# Altium project SISPS-PV.PrjPcb (part 3 of 4)

## Sheet Bias Regulators 1.SchDoc: System Bias Regulators
size A4; ApprovedBy: LD Stanton; CheckedBy: None; Author: LD Stanton; CompanyName: University of Cape Town; DrawnBy: Lawrence Stanton; Engineer: Lawrence Stanton; Organization: University of Cape Town; Address1: Department of Electrical Engineering; Address2: Rondebosch; Address3: Cape Town; Address4: South Africa 7701; DocumentNumber: 9; SheetNumber: 9; SheetTotal: 20; Approv_Date_Eng: --/--/----; Approv_Date_Chk: --/--/----; PCB_Doc: TBD; ASM_Doc: TBD; FAB_Doc: TBD; CML_Doc: TBD; BOM_Doc: TBD
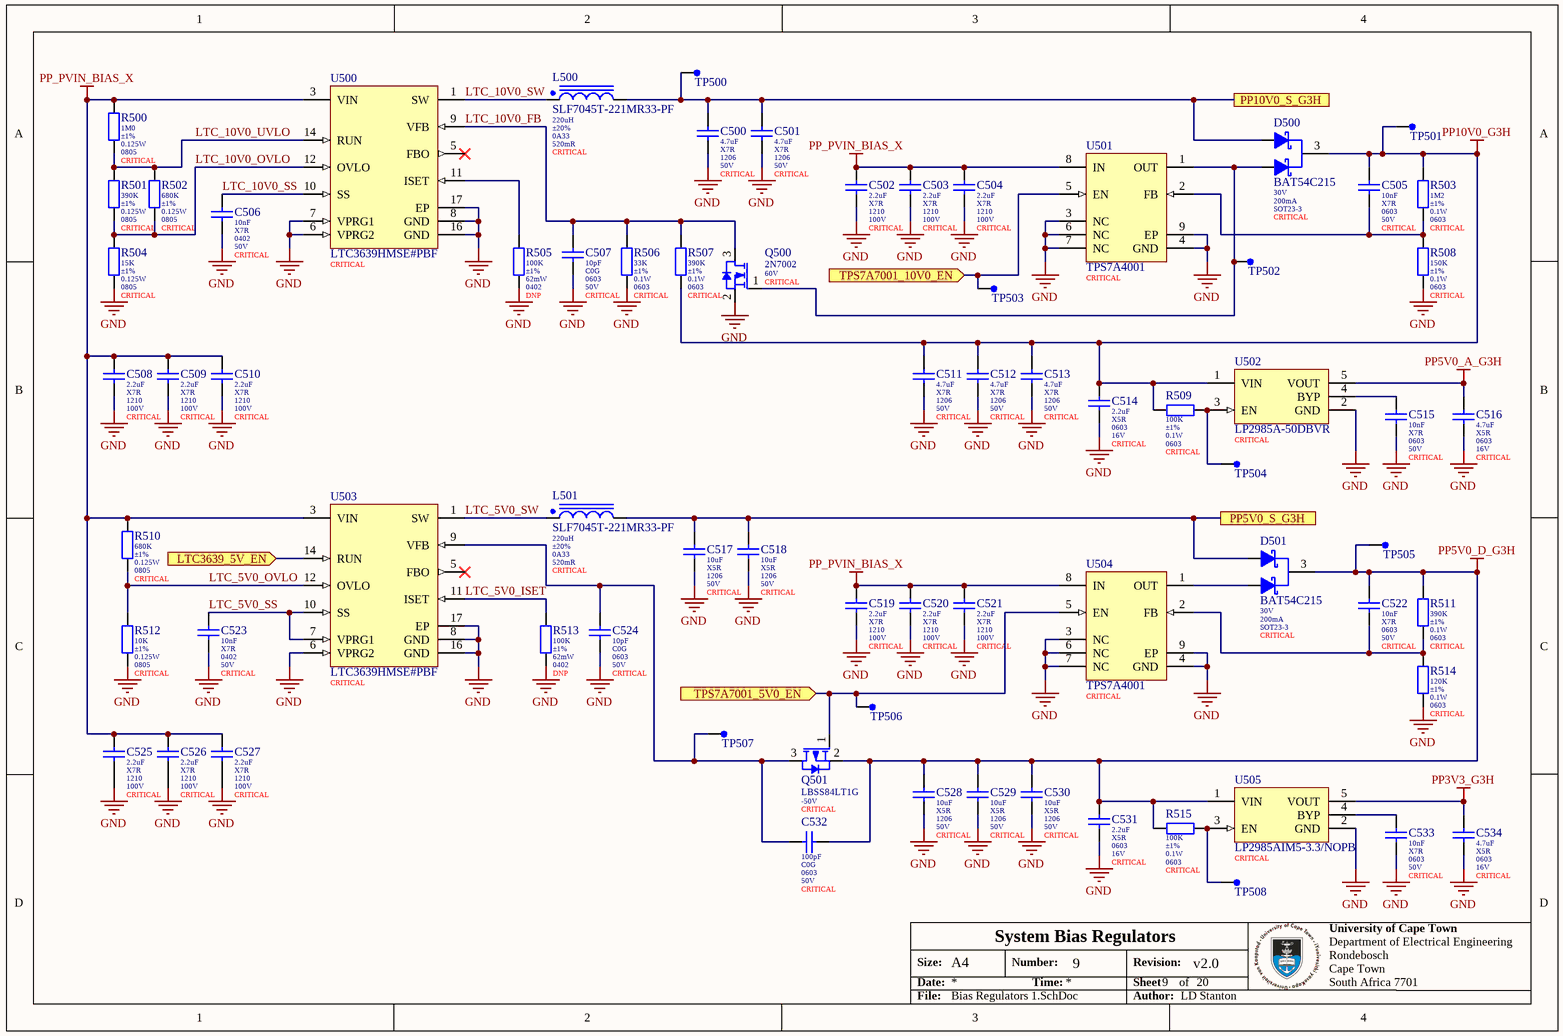
[diagram p11: Bias Regulators 1.SchDoc]

### Parts
C500  value 4.7uF  Dielectric: X7R  Package: 1206  Voltage: 50V  Populate: CRITICAL  [1206_125 (Guandong) B]  (hidden comment: 1206B475K500NT)
C501  value 4.7uF  Dielectric: X7R  Package: 1206  Voltage: 50V  Populate: CRITICAL  [1206_125 (Guandong) B]  (hidden comment: 1206B475K500NT)
C502  value 2.2uF  Dielectric: X7R  Package: 1210  Voltage: 100V  Populate: CRITICAL  [1212_250_J (Samsumg) B]  (hidden comment: CL32B225KCJSNNE)
C503  value 2.2uF  Dielectric: X7R  Package: 1210  Voltage: 100V  Populate: CRITICAL  [1212_250_J (Samsumg) B]  (hidden comment: CL32B225KCJSNNE)
C504  value 2.2uF  Dielectric: X7R  Package: 1210  Voltage: 100V  Populate: CRITICAL  [1212_250_J (Samsumg) B]  (hidden comment: CL32B225KCJSNNE)
C505  value 10nF  Dielectric: X7R  Package: 0603  Voltage: 50V  Populate: CRITICAL  [0603_080 (Guandong) B]  (hidden comment: 0603B103K500NT)
C506  value 10nF  Dielectric: X7R  Package: 0402  Voltage: 50V  Populate: CRITICAL  [0402_050_5 (Samsumg) B]  (hidden comment: CL05B103KB5NNNC)
C507  value 10pF  Dielectric: C0G  Package: 0603  Voltage: 50V  Populate: CRITICAL  [0603_080_8 (Samsung) B]  (hidden comment: CL10C100JB8NNNC)
C508  value 2.2uF  Dielectric: X7R  Package: 1210  Voltage: 100V  Populate: CRITICAL  [1212_250_J (Samsumg) B]  (hidden comment: CL32B225KCJSNNE)
C509  value 2.2uF  Dielectric: X7R  Package: 1210  Voltage: 100V  Populate: CRITICAL  [1212_250_J (Samsumg) B]  (hidden comment: CL32B225KCJSNNE)
C510  value 2.2uF  Dielectric: X7R  Package: 1210  Voltage: 100V  Populate: CRITICAL  [1212_250_J (Samsumg) B]  (hidden comment: CL32B225KCJSNNE)
C511  value 4.7uF  Dielectric: X7R  Package: 1206  Voltage: 50V  Populate: CRITICAL  [1206_125 (Guandong) B]  (hidden comment: 1206B475K500NT)
C512  value 4.7uF  Dielectric: X7R  Package: 1206  Voltage: 50V  Populate: CRITICAL  [1206_125 (Guandong) B]  (hidden comment: 1206B475K500NT)
C513  value 4.7uF  Dielectric: X7R  Package: 1206  Voltage: 50V  Populate: CRITICAL  [1206_125 (Guandong) B]  (hidden comment: 1206B475K500NT)
C514  value 2.2uF  Dielectric: X5R  Package: 0603  Voltage: 16V  Populate: CRITICAL  [0603_080_8 (Samsung) B]  (hidden comment: CL10A225KO8NNNC)
C515  value 10nF  Dielectric: X7R  Package: 0603  Voltage: 50V  Populate: CRITICAL  [0603_080 (Guandong) B]  (hidden comment: 0603B103K500NT)
C516  value 4.7uF  Dielectric: X5R  Package: 0603  Voltage: 16V  Populate: CRITICAL  [0603_080_8 (Samsung) B]  (hidden comment: CL10A475KO8NNNC)
C517  value 10uF  Dielectric: X5R  Package: 1206  Voltage: 50V  Populate: CRITICAL  [1206_160_H (Samsumg) B]  (hidden comment: CL31A106KBHNNNE)
C518  value 10uF  Dielectric: X5R  Package: 1206  Voltage: 50V  Populate: CRITICAL  [1206_160_H (Samsumg) B]  (hidden comment: CL31A106KBHNNNE)
C519  value 2.2uF  Dielectric: X7R  Package: 1210  Voltage: 100V  Populate: CRITICAL  [1212_250_J (Samsumg) B]  (hidden comment: CL32B225KCJSNNE)
C520  value 2.2uF  Dielectric: X7R  Package: 1210  Voltage: 100V  Populate: CRITICAL  [1212_250_J (Samsumg) B]  (hidden comment: CL32B225KCJSNNE)
C521  value 2.2uF  Dielectric: X7R  Package: 1210  Voltage: 100V  Populate: CRITICAL  [1212_250_J (Samsumg) B]  (hidden comment: CL32B225KCJSNNE)
C522  value 10nF  Dielectric: X7R  Package: 0603  Voltage: 50V  Populate: CRITICAL  [0603_080 (Guandong) B]  (hidden comment: 0603B103K500NT)
C523  value 10nF  Dielectric: X7R  Package: 0402  Voltage: 50V  Populate: CRITICAL  [0402_050_5 (Samsumg) B]  (hidden comment: CL05B103KB5NNNC)
C524  value 10pF  Dielectric: C0G  Package: 0603  Voltage: 50V  Populate: CRITICAL  [0603_080_8 (Samsung) B]  (hidden comment: CL10C100JB8NNNC)
C525  value 2.2uF  Dielectric: X7R  Package: 1210  Voltage: 100V  Populate: CRITICAL  [1212_250_J (Samsumg) B]  (hidden comment: CL32B225KCJSNNE)
C526  value 2.2uF  Dielectric: X7R  Package: 1210  Voltage: 100V  Populate: CRITICAL  [1212_250_J (Samsumg) B]  (hidden comment: CL32B225KCJSNNE)
C527  value 2.2uF  Dielectric: X7R  Package: 1210  Voltage: 100V  Populate: CRITICAL  [1212_250_J (Samsumg) B]  (hidden comment: CL32B225KCJSNNE)
C528  value 10uF  Dielectric: X5R  Package: 1206  Voltage: 50V  Populate: CRITICAL  [1206_160_H (Samsumg) B]  (hidden comment: CL31A106KBHNNNE)
C529  value 10uF  Dielectric: X5R  Package: 1206  Voltage: 50V  Populate: CRITICAL  [1206_160_H (Samsumg) B]  (hidden comment: CL31A106KBHNNNE)
C530  value 10uF  Dielectric: X5R  Package: 1206  Voltage: 50V  Populate: CRITICAL  [1206_160_H (Samsumg) B]  (hidden comment: CL31A106KBHNNNE)
C531  value 2.2uF  Dielectric: X5R  Package: 0603  Voltage: 16V  Populate: CRITICAL  [0603_080_8 (Samsung) B]  (hidden comment: CL10A225KO8NNNC)
C532  value 100pF  Dielectric: C0G  Package: 0603  Voltage: 50V  Populate: CRITICAL  [0603_080_8 (Samsung) B]  (hidden comment: CL10C101JB8NNNC)
C533  value 10nF  Dielectric: X7R  Package: 0603  Voltage: 50V  Populate: CRITICAL  [0603_080 (Guandong) B]  (hidden comment: 0603B103K500NT)
C534  value 4.7uF  Dielectric: X5R  Package: 0603  Voltage: 16V  Populate: CRITICAL  [0603_080_8 (Samsung) B]  (hidden comment: CL10A475KO8NNNC)
D500  BAT54C215  Reverse Voltage: 30V  Forward Current: 200mA  Package: SOT23-3  Placement: CRITICAL  [SOT-23-3 (BAT54C215) A]
D501  BAT54C215  Reverse Voltage: 30V  Forward Current: 200mA  Package: SOT23-3  Placement: CRITICAL  [SOT-23-3 (BAT54C215) A]
L500  SLF7045T-221MR33-PF  value 220uH  Tolerance: ±20%  Rated Current: 0A33  DC Resistance: 520mR  Populate: CRITICAL  [SLF7045 B]
L501  SLF7045T-221MR33-PF  value 220uH  Tolerance: ±20%  Rated Current: 0A33  DC Resistance: 520mR  Populate: CRITICAL  [SLF7045 B]
Q500  2N7002  Maximum Drain Source Voltage: 60V  Placement: CRITICAL  [SOT-23-3 (2N7002) B]
Q501  LBSS84LT1G  Maximum Drain Source Voltage: -50V  Placement: CRITICAL  [SOT-23-3 (LBSS84) B]
R500  value 1M0  Tolerance: ±1%  Power: 0.125W  Package: 0805  Populate: CRITICAL  [0805 (Uniroyal) B]  (hidden comment: 0805W8F1004T5E)
R501  value 390K  Tolerance: ±1%  Power: 0.125W  Package: 0805  Populate: CRITICAL  [0805 (Uniroyal) B]  (hidden comment: 0805W8F3903T5E)
R502  value 680K  Tolerance: ±1%  Power: 0.125W  Package: 0805  Populate: CRITICAL  [0805 (Uniroyal) B]  (hidden comment: 0805W8F6803T5E)
R503  value 1M2  Tolerance: ±1%  Power: 0.1W  Package: 0603  Populate: CRITICAL  [0603 (Uniroyal) B]  (hidden comment: 0603WAF1204T5E)
R504  value 15K  Tolerance: ±1%  Power: 0.125W  Package: 0805  Populate: CRITICAL  [0805 (Uniroyal) B]  (hidden comment: 0805W8F1502T5E)
R505  value 100K  Tolerance: ±1%  Power: 62mW  Package: 0402  Populate: DNP  [0402 (Uniroyal) B]  (hidden comment: 0402WGF1003TCE)
R506  value 33K  Tolerance: ±1%  Power: 0.1W  Package: 0603  Populate: CRITICAL  [0603 (Uniroyal) B]  (hidden comment: 0603WAF3302T5E)
R507  value 390K  Tolerance: ±1%  Power: 0.1W  Package: 0603  Populate: CRITICAL  [0603 (Uniroyal) B]  (hidden comment: 0603WAF3903T5E)
R508  value 150K  Tolerance: ±1%  Power: 0.1W  Package: 0603  Populate: CRITICAL  [0603 (Uniroyal) B]  (hidden comment: 0603WAF1503T5E)
R509  value 100K  Tolerance: ±1%  Power: 0.1W  Package: 0603  Populate: CRITICAL  [0603 (Uniroyal) B]  (hidden comment: 0603WAF1003T5E)
R510  value 680K  Tolerance: ±1%  Power: 0.125W  Package: 0805  Populate: CRITICAL  [0805 (Uniroyal) B]  (hidden comment: 0805W8F6803T5E)
R511  value 390K  Tolerance: ±1%  Power: 0.1W  Package: 0603  Populate: CRITICAL  [0603 (Uniroyal) B]  (hidden comment: 0603WAF3903T5E)
R512  value 10K  Tolerance: ±1%  Power: 0.125W  Package: 0805  Populate: CRITICAL  [0805 (Uniroyal) B]  (hidden comment: 0805W8F1002T5E)
R513  value 100K  Tolerance: ±1%  Power: 62mW  Package: 0402  Populate: DNP  [0402 (Uniroyal) B]  (hidden comment: 0402WGF1003TCE)
R514  value 120K  Tolerance: ±1%  Power: 0.1W  Package: 0603  Populate: CRITICAL  [0603 (Uniroyal) B]  (hidden comment: 0603WAF1203T5E)
R515  value 100K  Tolerance: ±1%  Power: 0.1W  Package: 0603  Populate: CRITICAL  [0603 (Uniroyal) B]  (hidden comment: 0603WAF1003T5E)
TP500  Test Point  [Test Point Pad 1.0mm]  (value not drawn)  (no BOM)
TP501  Test Point  [Test Point Pad 1.0mm]  (value not drawn)  (no BOM)
TP502  Test Point  [Test Point Pad 1.0mm]  (value not drawn)  (no BOM)
TP503  Test Point  [Test Point Pad 1.0mm]  (value not drawn)  (no BOM)
TP504  Test Point  [Test Point Pad 1.0mm]  (value not drawn)  (no BOM)
TP505  Test Point  [Test Point Pad 1.0mm]  (value not drawn)  (no BOM)
TP506  Test Point  [Test Point Pad 1.0mm]  (value not drawn)  (no BOM)
TP507  Test Point  [Test Point Pad 1.0mm]  (value not drawn)  (no BOM)
TP508  Test Point  [Test Point Pad 1.0mm]  (value not drawn)  (no BOM)
U500  LTC3639HMSE#PBF  Placement: CRITICAL  [LT-MSE-16-V(12)4PR-EDP_N]
U501  TPS7A4001  Placement: CRITICAL  [DGN0008B_N]
U502  LP2985A-50DBVR  Placement: CRITICAL  [SOT-23-5 (DBV0005A) B]
U503  LTC3639HMSE#PBF  Placement: CRITICAL  [LT-MSE-16-V(12)4PR-EDP_N]
U504  TPS7A4001  Placement: CRITICAL  [DGN0008B_N]
U505  LP2985AIM5-3.3/NOPB  Placement: CRITICAL  [SOT-23-5 (DBV0005A) B]

### Ports
LTC3639_5V_EN (in), PP5V0_S_G3H, PP10V0_S_G3H, TPS7A7001_5V0_EN (in), TPS7A7001_10V0_EN (in)

### Nets
GND: C500.2 C501.2 C502.2 C503.2 C504.2 C506.2 C507.2 C508.2 C509.2 C510.2 C511.2 C512.2 C513.2 C514.2 C515.2 C516.2 C517.2 C518.2 C519.2 C520.2 C521.2 C523.2 C524.2 C525.2 C526.2 C527.2 C528.2 C529.2 C530.2 C531.2 C533.2 C534.2 Q500.2(S) R504.2 R505.2 R506.2 R508.2 R512.2 R513.2 R514.2 U500.6(VPRG2) U500.7(VPRG1) U500.8(GND) U500.16(GND) U500.17(EP) U501.3(NC) U501.4(GND) U501.6(NC) U501.7(NC) U501.9(EP) U502.2(GND) U503.6(VPRG2) U503.8(GND) U503.16(GND) U503.17(EP) U504.3(NC) U504.4(GND) U504.6(NC) U504.7(NC) U504.9(EP) U505.2(GND)
PP3V3_G3H: C534.1 U505.5(VOUT)
PP5V0_A_G3H: C516.1 U502.5(VOUT)
PP5V0_D_G3H: C522.1 C528.1 C529.1 C530.1 C531.1 C532.2 D501.3(K) Q501.2(S) R511.1 R515.1 TP505.1 U505.1(VIN)
PP10V0_G3H: C505.1 C511.1 C512.1 C513.1 C514.1 D500.3(K) R503.1 R507.2 R509.1 TP501.1 U502.1(VIN)
PP_PVIN_BIAS_X: C502.1 C503.1 C504.1 C508.1 C509.1 C510.1 C519.1 C520.1 C521.1 C525.1 C526.1 C527.1 R500.1 R510.1 U500.3(VIN) U501.8(IN) U503.3(VIN) U504.8(IN)
LTC3639_5V_EN: U503.14(RUN) ; port LTC3639_5V_EN
LTC_5V0_ISET: R513.1 U503.11(ISET)
LTC_5V0_OVLO: R510.2 R512.1 U503.12(OVLO)
LTC_5V0_SS: C523.1 U503.7(VPRG1) U503.10(SS)
LTC_5V0_SW: L501.1 U503.1(SW)
LTC_10V0_FB: C507.1 Q500.3(D) R506.1 R507.1 U500.9(VFB)
LTC_10V0_OVLO: R501.2 R502.2 R504.1 U500.12(OVLO)
LTC_10V0_SS: C506.1 U500.10(SS)
LTC_10V0_SW: L500.1 U500.1(SW)
LTC_10V0_UVLO: R500.2 R501.1 R502.1 U500.14(RUN)
PP5V0_S_G3H: C517.1 C518.1 D501.1(A1) L501.2 ; port PP5V0_S_G3H
PP10V0_S_G3H: C500.1 C501.1 D500.1(A1) L500.2 TP500.1 ; port PP10V0_S_G3H
TPS7A7001_5V0_EN: Q501.1(G) TP506.1 U504.5(EN) ; port TPS7A7001_5V0_EN
TPS7A7001_10V0_EN: TP503.1 U501.5(EN) ; port TPS7A7001_10V0_EN
NetC505_2: C505.2 R503.2 R508.1 U501.2(FB)
NetC515_1: C515.1 U502.4(BYP)
NetC522_2: C522.2 R511.2 R514.1 U504.2(FB)
NetC524_1: C524.1 C532.1 Q501.3(D) TP507.1 U503.9(VFB)
NetC533_1: C533.1 U505.4(BYP)
NetD500_2: D500.2(A2) Q500.1(G) TP502.1 U501.1(OUT)
NetD501_2: D501.2(A2) U504.1(OUT)
NetR505_1: R505.1 U500.11(ISET)
NetR509_2: R509.2 TP504.1 U502.3(EN)
NetR515_2: R515.2 TP508.1 U505.3(EN)

Not connected (* = marked no-connect by the designer): U500 5(FBO)*; U503 5(FBO)*

### Notes on the sheet
- Size:
- Date:
- A4
- Number:
- Time:
- Revision:
- Sheet
- of
- File:
- Author:

### Library data of the parts
C500 C501 C511-C513 = CMP-014-000005-9: MLCC 4.7uF 1206 50V X7R ±10%; Manufacturer: Guandong; Tolerance: ±15%; ComponentLink1URL: https://datasheet.lcsc.com/szlcsc/Guangdong-Fenghua-Advanced-Tech-0402B102K500NT_C1523.pdf; ComponentLink1Description: Datasheet; LCSC Part Number: C29823
C502-C504 C508-C510 C519-C521 C525-C527 = CMP-014-000010-1: MLCC 2.2uF 1210 100V X7R ±10%; Manufacturer: Samsung; LCSC Part Number: C55151; Tolerance: ±10%; ComponentLink1URL: https://datasheet.lcsc.com/szlcsc/Samsung-Electro-Mechanics-CL05C100JB5NNNC_C32949.pdf; ComponentLink1Description: Datasheet
C505 C522 = CMP-014-000000-11: MLCC 10nF 0603 50V X7R ±10%; Manufacturer: Guandong; Tolerance: ±15%; ComponentLink1Description: Datasheet; LCSC Part Number: C57112; ComponentLink1URL: https://datasheet.lcsc.com/szlcsc/Guangdong-Fenghua-Advanced-Tech-0402B102K500NT_C1523.pdf
C506 C523 = CMP-045-000005-9: MLCC 10nF 0402 50V X7R ±10%; Manufacturer: Samsung; ComponentLink1Description: Datasheet; ComponentLink1URL: https://datasheet.lcsc.com/szlcsc/Samsung-Electro-Mechanics-CL05C100JB5NNNC_C32949.pdf; Tolerance: ±10%; LCSC Part Number: C15195
C507 C524 = CMP-045-000007-7: MLCC 10pF 0603 C0G ±0.1pF; Manufacturer: Samsung; ComponentLink1URL: https://datasheet.lcsc.com/szlcsc/Samsung-Electro-Mechanics-CL05C100JB5NNNC_C32949.pdf; Tolerance: ±0.1pF; LCSC Part Number: C1634; ComponentLink1Description: Datasheet
C514 C531 = CMP-045-000016-8: MLCC 2.2uF 0603 16V X5R ±10%; Manufacturer: Samsung; Tolerance: ±10%; LCSC Part Number: C23630; ComponentLink1URL: https://datasheet.lcsc.com/szlcsc/Samsung-Electro-Mechanics-CL05C100JB5NNNC_C32949.pdf; ComponentLink1Description: Datasheet
C515 C533 = CMP-014-000000-10: MLCC 10nF 0603 50V X7R ±10%; Manufacturer: Guandong; Tolerance: ±15%; LCSC Part Number: C57112; ComponentLink1URL: https://datasheet.lcsc.com/szlcsc/Guangdong-Fenghua-Advanced-Tech-0402B102K500NT_C1523.pdf; ComponentLink1Description: Datasheet
C516 C534 = CMP-014-000007-5: MLCC 4.7uF 0603 16V X5R ±10%; Manufacturer: Samsung; LCSC Part Number: C19666; Tolerance: ±10%; ComponentLink1Description: Datasheet; ComponentLink1URL: https://datasheet.lcsc.com/szlcsc/Samsung-Electro-Mechanics-CL05C100JB5NNNC_C32949.pdf
C517 C518 C528-C530 = CMP-045-000010-7: MLCC 10uF 1206 50V X5R ±10%; Manufacturer: Samsung; ComponentLink1Description: Datasheet; ComponentLink1URL: https://datasheet.lcsc.com/szlcsc/Samsung-Electro-Mechanics-CL05C100JB5NNNC_C32949.pdf; LCSC Part Number: C13585; Tolerance: ±10%
C532 = CMP-045-000015-8: MLCC 100pF 0603 50V C0G ±0.1pF; Manufacturer: Samsung; ComponentLink1Description: Datasheet; LCSC Part Number: C14858; ComponentLink1URL: https://datasheet.lcsc.com/szlcsc/Samsung-Electro-Mechanics-CL05C100JB5NNNC_C32949.pdf; Tolerance: ±0.1pF
D500 D501 = CMP-022-000010-3: Schottky Barrier Diode Common Cathode 30V 200mA; Manufacturer: NXP; Forward Voltage: 800mV; Max Surge Current: 600mA; ComponentLink1Description: Datasheet; ComponentLink1URL: https://datasheet.lcsc.com/lcsc/1811141223_Nexperia-BAT54C,215_C37704.pdf; Min Operating Temperature: -65°C; Max Operating Temperature: 150°C; LCSC Part Number: C37704
L500 L501 = CMP-032-000004-1: Inductor 220uH ±20% 0A65 470mR Wirewound Shielded; Manufacturer: TDK; Core: Ferrite; Saturation Current: 0A33; ComponentLink1URL: https://product.tdk.com/system/files/dam/doc/product/inductor/inductor/smd/catalog/inductor_commercial_power_slf7045_en.pdf; RoHS: Yes; ComponentLink1Description: Datasheet; Shielding: Shielded; LCSC Part Number: C24679; Min Operating Temperature: -40°C; Max Operating Temperature: 85°C
Q500 = CMP-040-000000-13: Small Signal MOSFET, 500 mA, 60 V, N-Channel, Enhancement, JCET SOT-23-3; Gate Threshold Voltage: 2V5; Maximum Gate Source Voltage: ±20V; Power: 0.225W; Drain-Source On Resistance: 7R; Maximum Drain Current: 0.2A; ComponentLink1URL: https://datasheet.lcsc.com/szlcsc/Changjiang-Electronics-Tech-CJ-2N7002_C8545.pdf; Package: SOT-23-3; Manufacturer: JCET; ComponentLink1Description: Datasheet; LCSC Part Number: C8545
Q501 = CMP-040-000004-6: Small Signal MOSFET, 130 mA, 50 V, P-Channel, Enhancement, LRC SOT-23-3; Manufacturer: Leshan Radio Company; Maximum Gate Source Voltage: ±20V; Drain-Source On Resistance: 10R; Gate Threshold Voltage: 2V0; Power: 0.225W; Maximum Drain Current: 0.13A; LCSC Part Number: C8492; ComponentLink1Description: Datasheet; Package: SOT-23-3; ComponentLink1URL: https://datasheet.lcsc.com/szlcsc/Leshan-Radio-LBSS84LT1G_C8492.pdf
R500 = CMP-010-000314-12: Resistor 1M0 0805 ±1% Thick Film Uniroyal; Working Voltage: 150V; Temperature Coefficient: ±100ppm/K; ComponentLink1Description: Datasheet; Pin Count: 2; Temperature: -55 - 155°C; LCSC Part Number: C17514; ComponentLink1URL: https://datasheet.lcsc.com/szlcsc/1811062009_UNI-ROYAL-Uniroyal-Elec-0603WAF1002T5E_C25804.pdf; Manufacturer: Uniroyal
R501 = CMP-010-000369-2: Resistor 390K 0805 ±1% Thick Film Uniroyal; Working Voltage: 150V; Temperature Coefficient: ±100ppm/K; Temperature: -55 - 155°C; LCSC Part Number: C17656; Pin Count: 2; ComponentLink1Description: Datasheet; Manufacturer: Uniroyal; ComponentLink1URL: https://datasheet.lcsc.com/szlcsc/1811062009_UNI-ROYAL-Uniroyal-Elec-0603WAF1002T5E_C25804.pdf
R502 R510 = CMP-010-000371-3: Resistor 680K 0805 ±1% Thick Film Uniroyal; Working Voltage: 150V; Temperature Coefficient: ±100ppm/K; LCSC Part Number: C17797; ComponentLink1Description: Datasheet; ComponentLink1URL: https://datasheet.lcsc.com/szlcsc/1811062009_UNI-ROYAL-Uniroyal-Elec-0603WAF1002T5E_C25804.pdf; Pin Count: 2; Temperature: -55 - 155°C; Manufacturer: Uniroyal
R503 = CMP-010-000374-3: Resistor 1M2 0603 ±1% Thick Film Uniroyal; Temperature Coefficient: ±100ppm/K; Working Voltage: 50V; Temperature: -55 - 155°C; Pin Count: 2; ComponentLink1URL: https://datasheet.lcsc.com/szlcsc/1811062009_UNI-ROYAL-Uniroyal-Elec-0603WAF1002T5E_C25804.pdf; Manufacturer: Uniroyal; LCSC Part Number: C13315; ComponentLink1Description: Datasheet
R504 = CMP-010-000373-3: Resistor 15K 0805 ±1% Thick Film Uniroyal; Working Voltage: 150V; Temperature Coefficient: ±100ppm/K; Pin Count: 2; Temperature: -55 - 155°C; ComponentLink1Description: Datasheet; Manufacturer: Uniroyal; LCSC Part Number: C17475; ComponentLink1URL: https://datasheet.lcsc.com/szlcsc/1811062009_UNI-ROYAL-Uniroyal-Elec-0603WAF1002T5E_C25804.pdf
R505 R513 = CMP-010-000287-13: Resistor 100K 0402 ±1% Thick Film Uniroyal; Temperature Coefficient: ±100ppm/K; Working Voltage: 50V; Pin Count: 2; ComponentLink1Description: Datasheet; Temperature: -55 - 155°C; LCSC Part Number: C25741; Manufacturer: Uniroyal; ComponentLink1URL: https://datasheet.lcsc.com/szlcsc/1811062009_UNI-ROYAL-Uniroyal-Elec-0603WAF1002T5E_C25804.pdf
R506 = CMP-010-000332-9: Resistor 33K 0603 ±1% Thick Film Uniroyal; Working Voltage: 50V; Temperature Coefficient: ±100ppm/K; LCSC Part Number: C4216; ComponentLink1Description: Datasheet; Pin Count: 2; Manufacturer: Uniroyal; ComponentLink1URL: https://datasheet.lcsc.com/szlcsc/1811062009_UNI-ROYAL-Uniroyal-Elec-0603WAF1002T5E_C25804.pdf; Temperature: -55 - 155°C
R507 R511 = CMP-010-000378-2: Resistor 390K 0603 ±1% Thick Film Uniroyal; Working Voltage: 50V; Temperature Coefficient: ±100ppm/K; Pin Count: 2; Manufacturer: Uniroyal; LCSC Part Number: C23150; ComponentLink1Description: Datasheet; Temperature: -55 - 155°C; ComponentLink1URL: https://datasheet.lcsc.com/szlcsc/1811062009_UNI-ROYAL-Uniroyal-Elec-0603WAF1002T5E_C25804.pdf
R508 = CMP-010-000303-8: Resistor 150K 0603 ±1% Thick Film Uniroyal; Temperature Coefficient: ±100ppm/K; Working Voltage: 50V; Pin Count: 2; Temperature: -55 - 155°C; Manufacturer: Uniroyal; LCSC Part Number: C22807; ComponentLink1URL: https://datasheet.lcsc.com/szlcsc/1811062009_UNI-ROYAL-Uniroyal-Elec-0603WAF1002T5E_C25804.pdf; ComponentLink1Description: Datasheet
R509 R515 = CMP-010-000288-9: Resistor 100K 0603 ±1% Thick Film Uniroyal; Working Voltage: 50V; Temperature Coefficient: ±100ppm/K; Manufacturer: Uniroyal; ComponentLink1URL: https://datasheet.lcsc.com/szlcsc/1811062009_UNI-ROYAL-Uniroyal-Elec-0603WAF1002T5E_C25804.pdf; LCSC Part Number: C25803; Temperature: -55 - 155°C; ComponentLink1Description: Datasheet; Pin Count: 2
R512 = CMP-010-000400-1: Resistor 10K 0805 ±1% Thick Film Uniroyal; Working Voltage: 150V; Temperature Coefficient: ±100ppm/K; Pin Count: 2; Temperature: -55 - 155°C; Manufacturer: Uniroyal; LCSC Part Number: C17414; ComponentLink1Description: Datasheet; ComponentLink1URL: https://datasheet.lcsc.com/szlcsc/1811062009_UNI-ROYAL-Uniroyal-Elec-0603WAF1002T5E_C25804.pdf
R514 = CMP-010-000365-2: Resistor 120K 0603 ±1% Thick Film Uniroyal; Temperature Coefficient: ±100ppm/K; Working Voltage: 50V; Manufacturer: Uniroyal; Pin Count: 2; ComponentLink1URL: https://datasheet.lcsc.com/szlcsc/1811062009_UNI-ROYAL-Uniroyal-Elec-0603WAF1002T5E_C25804.pdf; LCSC Part Number: C25808; Temperature: -55 - 155°C; ComponentLink1Description: Datasheet
TP500-TP508 = CMP-00028-00001-8: Test Point Pad
U500 U503 = CMP-055-000003-5: DC-DC Conv 4V to 150V Synchronous Step Down Single-Out 0.8V to 150V 0.1A Automotive 12-Pin MSOP EP; Min Output Voltage: 800mV; Output Current: 100mA; RoHS: Yes; Max Output Voltage: 150V; ComponentLink1URL: https://www.analog.com/media/en/technical-documentation/data-sheets/3639fd.pdf; Min Input Voltage: 4V; ComponentLink1Description: Datasheet; Package: SOP; ComponentLink2Description: Design Note; Temperature: -40°C - 125°C; ComponentLink2URL: https://www.analog.com/media/en/reference-design-documentation/design-notes/dn532f.pdf
U501 U504 = CMP-008-000008-5: Adjustable LDO Voltage Regulator, 7 V to 100 V, 780 mV Drop, 1.161 V to 90 V / 50 mA out, MSOP-8; Reference Voltage: 1.185V; Max Input Voltage: 100V; Output Voltage: 90V; Max Output Current: 50mA; Quiescent Current: 20uA; Min Output Voltage: 1.2V; Max Power Dissipation: 833mW; Power: 1.83W; Min Input Voltage: 7V; Dropout Voltage: 780mV; LCSC Part Number: C55006; ComponentLink1URL: https://www.ti.com/lit/ds/symlink/tps7a4001.pdf?HQS=dis-dk-null-digikeymode-dsf-pf-null-wwe&ts=1626937665102&ref_url=https%253A%252F%252Fwww.digikey.de%252F; Package: MSOP; Max Output Voltage: 90V; RoHS: Yes; ComponentLink1Description: Datasheet; Output Current: 50mA; Temperature: -40°C - 125°C
U502 = CMP-008-000009-5: LDO Fixed 5V, 0.15A, 1% Accuracy, Max 16V Input, 65uA Iq, SOT-23-5; Manufacturer: Texas Instruments; Max Output Current: 150mA; Dropout Voltage: 280mV; Min Input Voltage: 2.2V; Quiescent Current: 65uA; Max Input Voltage: 16V; Max Supply Voltage: 16V; Accuracy: 1%; ComponentLink1Description: Datasheet; Max Operating Temperature: 125°C; ComponentLink1URL: https://www.ti.com/lit/ds/symlink/lp2985.pdf?ts=1627290889620&ref_url=https%253A%252F%252Fwww.google.com%252F; RoHS: Yes; Min Operating Temperature: -40°C; Max Output Voltage: 5V; Case/Package: SOT-23-5; LCSC Part Number: C109382; Output Voltage: 5V
U505 = CMP-008-000011-3: LDO Fixed 3V3, 0.15A, ±1% Accuracy, Max 16V Input, 65uA Iq, SOT-23-5; Manufacturer: Texas Instruments; Max Output Voltage: 3.3V; Dropout Voltage: 280mV; Min Input Voltage: 2.5V; Max Output Current: 150mA; Min Operating Temperature: -40°C; ComponentLink1Description: Datasheet; Quiescent Current: 65uA; Max Supply Voltage: 16V; Output Voltage: 3.3V; Case/Package: SOT-23-5; ComponentLink1URL: https://www.ti.com/lit/ds/symlink/lp2985-n.pdf?ts=1627305258113&ref_url=https%253A%252F%252Fwww.ti.com%252Fproduct%252FLP2985-N%253FkeyMatch%253DLP2985-N%2526tisearch%253Dsearch-everything%2526usecase%253DGPN; Max Operating Temperature: 125°C; Accuracy: 1%; RoHS: Yes; Max Input Voltage: 16V; LCSC Part Number: C16085

## Sheet Bias Regulators 2.SchDoc: System Bias Regulators - Comparitors
size A4; ApprovedBy: LD Stanton; Author: LD Stanton; CompanyName: University of Cape Town; DrawnBy: Lawrence Stanton; Engineer: Lawrence Stanton; Organization: University of Cape Town; Address1: Department of Electrical Engineering; Address2: Rondebosch; Address3: Cape Town; Address4: South Africa 7701; DocumentNumber: 10; SheetNumber: 10; SheetTotal: 20
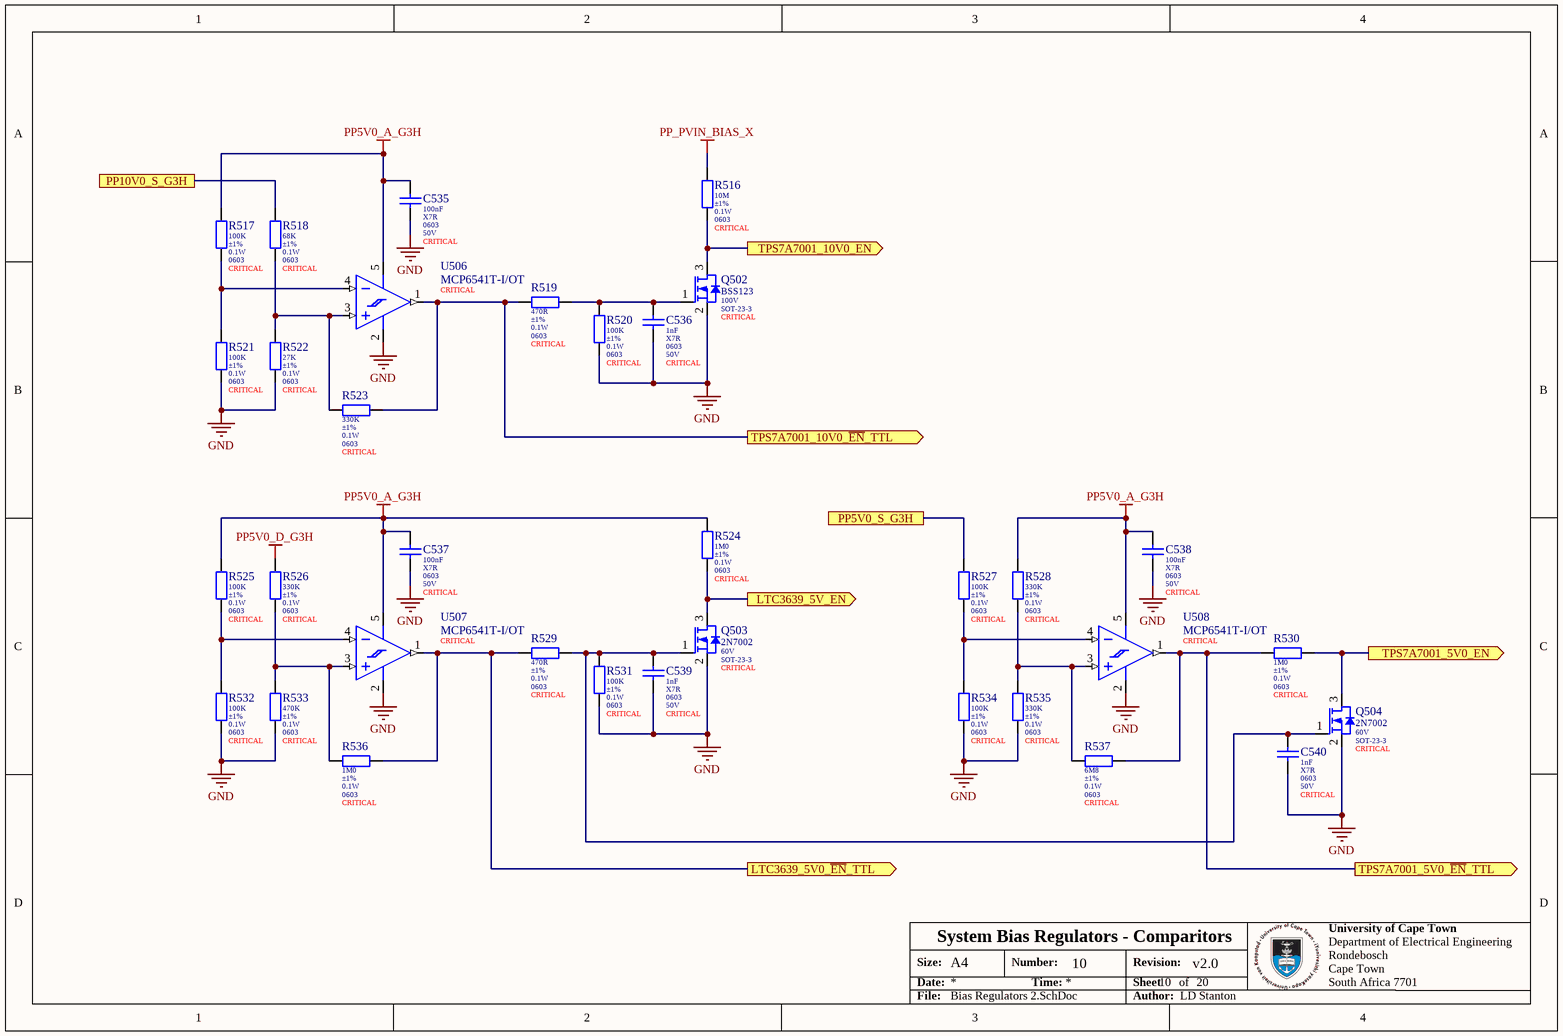
[diagram p12: Bias Regulators 2.SchDoc]

### Parts
C535  value 100nF  Dielectric: X7R  Package: 0603  Voltage: 50V  Populate: CRITICAL  [0603 (Yageo DA) B]  (hidden comment: CC0603KRX7R9BB104)
C536  value 1nF  Dielectric: X7R  Package: 0603  Voltage: 50V  Populate: CRITICAL  [0603_080_8 (Samsung) B]  (hidden comment: CL10B102KB8NNNC)
C537  value 100nF  Dielectric: X7R  Package: 0603  Voltage: 50V  Populate: CRITICAL  [0603 (Yageo DA) B]  (hidden comment: CC0603KRX7R9BB104)
C538  value 100nF  Dielectric: X7R  Package: 0603  Voltage: 50V  Populate: CRITICAL  [0603 (Yageo DA) B]  (hidden comment: CC0603KRX7R9BB104)
C539  value 1nF  Dielectric: X7R  Package: 0603  Voltage: 50V  Populate: CRITICAL  [0603_080_8 (Samsung) B]  (hidden comment: CL10B102KB8NNNC)
C540  value 1nF  Dielectric: X7R  Package: 0603  Voltage: 50V  Populate: CRITICAL  [0603_080_8 (Samsung) B]  (hidden comment: CL10B102KB8NNNC)
Q502  BSS123  Maximum Drain Source Voltage: 100V  Package: SOT-23-3  Placement: CRITICAL  [SOT-23-3 (2N7002) B]
Q503  2N7002  Maximum Drain Source Voltage: 60V  Package: SOT-23-3  Placement: CRITICAL  [SOT-23-3 (2N7002) B]
Q504  2N7002  Maximum Drain Source Voltage: 60V  Package: SOT-23-3  Placement: CRITICAL  [SOT-23-3 (2N7002) B]
R516  value 10M  Tolerance: ±1%  Power: 0.1W  Package: 0603  Populate: CRITICAL  [0603 (Uniroyal) B]  (hidden comment: 0603WAF1005T5E)
R517  value 100K  Tolerance: ±1%  Power: 0.1W  Package: 0603  Populate: CRITICAL  [0603 (Uniroyal) B]  (hidden comment: 0603WAF1003T5E)
R518  value 68K  Tolerance: ±1%  Power: 0.1W  Package: 0603  Populate: CRITICAL  [0603 (Uniroyal) B]  (hidden comment: 0603WAF6802T5E)
R519  value 470R  Tolerance: ±1%  Power: 0.1W  Package: 0603  Populate: CRITICAL  [0603 (Uniroyal) B]  (hidden comment: 0603WAF4700T5E)
R520  value 100K  Tolerance: ±1%  Power: 0.1W  Package: 0603  Populate: CRITICAL  [0603 (Uniroyal) B]  (hidden comment: 0603WAF1003T5E)
R521  value 100K  Tolerance: ±1%  Power: 0.1W  Package: 0603  Populate: CRITICAL  [0603 (Uniroyal) B]  (hidden comment: 0603WAF1003T5E)
R522  value 27K  Tolerance: ±1%  Power: 0.1W  Package: 0603  Populate: CRITICAL  [0603 (Uniroyal) B]  (hidden comment: 0603WAF2702T5E)
R523  value 330K  Tolerance: ±1%  Power: 0.1W  Package: 0603  Populate: CRITICAL  [0603 (Uniroyal) B]  (hidden comment: 0603WAF3303T5E)
R524  value 1M0  Tolerance: ±1%  Power: 0.1W  Package: 0603  Populate: CRITICAL  [0603 (Uniroyal) B]  (hidden comment: 0603WAF1004T5E)
R525  value 100K  Tolerance: ±1%  Power: 0.1W  Package: 0603  Populate: CRITICAL  [0603 (Uniroyal) B]  (hidden comment: 0603WAF1003T5E)
R526  value 330K  Tolerance: ±1%  Power: 0.1W  Package: 0603  Populate: CRITICAL  [0603 (Uniroyal) B]  (hidden comment: 0603WAF3303T5E)
R527  value 100K  Tolerance: ±1%  Power: 0.1W  Package: 0603  Populate: CRITICAL  [0603 (Uniroyal) B]  (hidden comment: 0603WAF1003T5E)
R528  value 330K  Tolerance: ±1%  Power: 0.1W  Package: 0603  Populate: CRITICAL  [0603 (Uniroyal) B]  (hidden comment: 0603WAF3303T5E)
R529  value 470R  Tolerance: ±1%  Power: 0.1W  Package: 0603  Populate: CRITICAL  [0603 (Uniroyal) B]  (hidden comment: 0603WAF4700T5E)
R530  value 1M0  Tolerance: ±1%  Power: 0.1W  Package: 0603  Populate: CRITICAL  [0603 (Uniroyal) B]  (hidden comment: 0603WAF1004T5E)
R531  value 100K  Tolerance: ±1%  Power: 0.1W  Package: 0603  Populate: CRITICAL  [0603 (Uniroyal) B]  (hidden comment: 0603WAF1003T5E)
R532  value 100K  Tolerance: ±1%  Power: 0.1W  Package: 0603  Populate: CRITICAL  [0603 (Uniroyal) B]  (hidden comment: 0603WAF1003T5E)
R533  value 470K  Tolerance: ±1%  Power: 0.1W  Package: 0603  Populate: CRITICAL  [0603 (Uniroyal) B]  (hidden comment: 0603WAF4703T5E)
R534  value 100K  Tolerance: ±1%  Power: 0.1W  Package: 0603  Populate: CRITICAL  [0603 (Uniroyal) B]  (hidden comment: 0603WAF1003T5E)
R535  value 330K  Tolerance: ±1%  Power: 0.1W  Package: 0603  Populate: CRITICAL  [0603 (Uniroyal) B]  (hidden comment: 0603WAF3303T5E)
R536  value 1M0  Tolerance: ±1%  Power: 0.1W  Package: 0603  Populate: CRITICAL  [0603 (Uniroyal) B]  (hidden comment: 0603WAF1004T5E)
R537  value 6M8  Tolerance: ±1%  Power: 0.1W  Package: 0603  Populate: CRITICAL  [0603 (Uniroyal) B]  (hidden comment: 0603WAF6804T5E)
U506  MCP6541T-I/OT  Placement: CRITICAL  [SOT-23-5 (MCP75x) B]
U507  MCP6541T-I/OT  Placement: CRITICAL  [SOT-23-5 (MCP75x) B]
U508  MCP6541T-I/OT  Placement: CRITICAL  [SOT-23-5 (MCP75x) B]

### Ports
LTC3639_5V0_~{EN}_TTL (out), LTC3639_5V_EN (out), PP5V0_S_G3H, PP10V0_S_G3H, TPS7A7001_5V0_EN (out), TPS7A7001_5V0_~{EN}_TTL (out), TPS7A7001_10V0_EN (out), TPS7A7001_10V0_~{EN}_TTL (out)

### Nets
GND: C535.2 C536.2 C537.2 C538.2 C539.2 C540.2 Q502.2(S) Q503.2(S) Q504.2(S) R520.2 R521.2 R522.2 R531.2 R532.2 R533.2 R534.2 R535.2 U506.2(VSS) U507.2(VSS) U508.2(VSS)
PP5V0_A_G3H: C535.1 C537.1 C538.1 R517.1 R524.1 R525.1 R528.1 U506.5(VDD) U507.5(VDD) U508.5(VDD)
PP5V0_D_G3H: R526.1
PP_PVIN_BIAS_X: R516.1
LTC3639_5V_EN: Q503.3(D) R524.2 ; port LTC3639_5V_EN
PP5V0_S_G3H: R527.1 ; port PP5V0_S_G3H
PP10V0_S_G3H: R518.1 ; port PP10V0_S_G3H
TPS7A7001_5V0_EN: Q504.3(D) R530.2 ; port TPS7A7001_5V0_EN
TPS7A7001_10V0_EN: Q502.3(D) R516.2 ; port TPS7A7001_10V0_EN
NetC536_1: C536.1 Q502.1(G) R519.2 R520.1
NetC539_1: C539.1 C540.1 Q503.1(G) Q504.1(G) R529.2 R531.1
NetR408_2: R529.1 R536.2 U507.1(OUT) ; port LTC3639_5V0_~{EN}_TTL
NetR409_2: R530.1 R537.2 U508.1(OUT) ; port TPS7A7001_5V0_~{EN}_TTL
NetR410_2: R519.1 R523.2 U506.1(OUT) ; port TPS7A7001_10V0_~{EN}_TTL
NetR517_2: R517.2 R521.1 U506.4(VIN-)
NetR518_2: R518.2 R522.1 R523.1 U506.3(VIN+)
NetR525_2: R525.2 R532.1 U507.4(VIN-)
NetR526_2: R526.2 R533.1 R536.1 U507.3(VIN+)
NetR527_2: R527.2 R534.1 U508.4(VIN-)
NetR528_2: R528.2 R535.1 R537.1 U508.3(VIN+)

### Notes on the sheet
- Size:
- Date:
- A4
- Number:
- Time:
- Revision:
- Sheet
- of
- File:
- Author:

### Library data of the parts
C535 C537 C538 = CMP-047-000000-7: MLCC 100nF 50V 0603 X7R ±10%; Manufacturer: Yageo; LCSC Part Number: C14663; Tolerance: ±10%; ComponentLink1URL: https://datasheet.lcsc.com/szlcsc/YAGEO-CC0603KRX7R9BB104_C14663.pdf; ComponentLink1Description: Datasheet
C536 C539 C540 = CMP-045-000000-8: MLCC 1nF 0603 50V X7R ±10%; Manufacturer: Samsung; Tolerance: ±10%; LCSC Part Number: C1588; ComponentLink1Description: Datasheet; ComponentLink1URL: https://datasheet.lcsc.com/szlcsc/Samsung-Electro-Mechanics-CL05C100JB5NNNC_C32949.pdf
Q502 = CMP-040-000009-11: Small Signal MOSFET, 170mA, 100V, N-Channel, Enhancement, JCET SOT-23-3; Power: 0.35W; Maximum Drain Current: 0.17A; Maximum Gate Source Voltage: ±20V; Drain-Source On Resistance: 10R; Gate Threshold Voltage: 2V8; Manufacturer: JCET; LCSC Part Number: C79015; ComponentLink1URL: https://datasheet.lcsc.com/lcsc/1809211016_Changjiang-Electronics-Tech--CJ-BSS123_C79015.pdf; ComponentLink1Description: Datasheet
Q503 Q504 = CMP-040-000000-14: Small Signal MOSFET, 500 mA, 60 V, N-Channel, Enhancement, JCET SOT-23-3; Drain-Source On Resistance: 7R; Maximum Gate Source Voltage: ±20V; Maximum Drain Current: 0.2A; Gate Threshold Voltage: 2V5; Power: 0.225W; LCSC Part Number: C8545; ComponentLink1URL: https://datasheet.lcsc.com/szlcsc/Changjiang-Electronics-Tech-CJ-2N7002_C8545.pdf; Manufacturer: JCET; ComponentLink1Description: Datasheet
R516 = CMP-010-000294-9: Resistor 10M 0603 ±1% Thick Film Uniroyal; Working Voltage: 75V; Temperature Coefficient: ±200ppm/K; Temperature: -55 - 155°C; Pin Count: 2; ComponentLink1URL: https://datasheet.lcsc.com/szlcsc/1811062009_UNI-ROYAL-Uniroyal-Elec-0603WAF1002T5E_C25804.pdf; Manufacturer: Uniroyal; LCSC Part Number: C7250; ComponentLink1Description: Datasheet
R517 R520 R521 R525 R527 R531 R532 R534 = CMP-010-000288-10: Resistor 100K 0603 ±1% Thick Film Uniroyal; Working Voltage: 75V; Temperature Coefficient: ±100ppm/K; Manufacturer: Uniroyal; ComponentLink1URL: https://datasheet.lcsc.com/szlcsc/1811062009_UNI-ROYAL-Uniroyal-Elec-0603WAF1002T5E_C25804.pdf; LCSC Part Number: C25803; Temperature: -55 - 155°C; ComponentLink1Description: Datasheet; Pin Count: 2
R518 = CMP-010-000350-9: Resistor 68K 0603 ±1% Thick Film Uniroyal; Working Voltage: 75V; Temperature Coefficient: ±100ppm/K; Manufacturer: Uniroyal; ComponentLink1Description: Datasheet; Temperature: -55 - 155°C; ComponentLink1URL: https://datasheet.lcsc.com/szlcsc/1811062009_UNI-ROYAL-Uniroyal-Elec-0603WAF1002T5E_C25804.pdf; Pin Count: 2; LCSC Part Number: C23231
R519 R529 = CMP-010-000381-2: Resistor 470R 0603 ±5% Thick Film Uniroyal; Working Voltage: 75V; Temperature Coefficient: ±100ppm/K; ComponentLink1Description: Datasheet; Manufacturer: Uniroyal; Temperature: -55 - 155°C; LCSC Part Number: C23179; ComponentLink1URL: https://datasheet.lcsc.com/szlcsc/1811062009_UNI-ROYAL-Uniroyal-Elec-0603WAF1002T5E_C25804.pdf; Pin Count: 2
R522 = CMP-010-000322-10: Resistor 27K 0603 ±1% Thick Film Uniroyal; Temperature Coefficient: ±100ppm/K; Working Voltage: 75V; Manufacturer: Uniroyal; LCSC Part Number: C22967; ComponentLink1Description: Datasheet; Temperature: -55 - 155°C; ComponentLink1URL: https://datasheet.lcsc.com/szlcsc/1811062009_UNI-ROYAL-Uniroyal-Elec-0603WAF1002T5E_C25804.pdf; Pin Count: 2
R523 R526 R528 R535 = CMP-010-000382-2: Resistor 330K 0603 ±1% Thick Film Uniroyal; Temperature Coefficient: ±100ppm/K; Working Voltage: 75V; Pin Count: 2; Manufacturer: Uniroyal; ComponentLink1URL: https://datasheet.lcsc.com/szlcsc/1811062009_UNI-ROYAL-Uniroyal-Elec-0603WAF1002T5E_C25804.pdf; LCSC Part Number: C23137; Temperature: -55 - 155°C; ComponentLink1Description: Datasheet
R524 R530 R536 = CMP-010-000313-12: Resistor 1M0 0603 ±1% Thick Film Uniroyal; Working Voltage: 75V; Temperature Coefficient: ±100ppm/K; Manufacturer: Uniroyal; Pin Count: 2; LCSC Part Number: C22935; Temperature: -55 - 155°C; ComponentLink1Description: Datasheet; ComponentLink1URL: https://datasheet.lcsc.com/szlcsc/1811062009_UNI-ROYAL-Uniroyal-Elec-0603WAF1002T5E_C25804.pdf
R533 = CMP-010-000402-2: Resistor 470K 0603 ±1% Thick Film Uniroyal; Temperature Coefficient: ±100ppm/K; Working Voltage: 75V; ComponentLink1URL: https://datasheet.lcsc.com/szlcsc/1811062009_UNI-ROYAL-Uniroyal-Elec-0603WAF1002T5E_C25804.pdf; Pin Count: 2; Temperature: -55 - 155°C; LCSC Part Number: C23178; ComponentLink1Description: Datasheet; Manufacturer: Uniroyal
R537 = CMP-010-000375-3: Resistor 6M8 0603 ±1% Thick Film Uniroyal; Temperature Coefficient: ±200ppm/K; Working Voltage: 75V; ComponentLink1Description: Datasheet; Temperature: -55 - 155°C; ComponentLink1URL: https://datasheet.lcsc.com/szlcsc/1811062009_UNI-ROYAL-Uniroyal-Elec-0603WAF1002T5E_C25804.pdf; LCSC Part Number: C23213; Manufacturer: Uniroyal; Pin Count: 2
U506-U508 = CMP-000025-4: Comparator, Push-Pull, 1V6-5V5, 600nA,  SOT-23-5; Min Supply Voltage: 1.6V; Max Supply Voltage: 5.5V; Propagation Delay: 8us; Quiescent Current: 1uA; Nominal Supply Current: 1mA; Input Bias Current: 1pA; Input Offset Voltage (Vos): 7mV; Hysteresis: 6.5mV; Output Current: 2mA; Package: SOT-23-5; ComponentLink1Description: Datasheet; Output Type: Push-Pull; Min Operating Temperature: -40°C; RoHS: Yes; Max Operating Temperature: 85°C; ComponentLink1URL: https://ww1.microchip.com/downloads/en/DeviceDoc/MCP6541%20Output%20SubMicroamp%20Comparators%2020001696K.pdf; LCSC Part Number: C80839

## Sheet Backplane.SchDoc: Backplane
size A4; ApprovedBy: LD Stanton; Author: LD Stanton; CompanyName: University of Cape Town; DrawnBy: Lawrence Stanton; Engineer: Lawrence Stanton; Organization: University of Cape Town; Address1: Department of Electrical Engineering; Address2: Rondebosch; Address3: Cape Town; Address4: South Africa 7701; DocumentNumber: 4; SheetNumber: 4; SheetTotal: 20
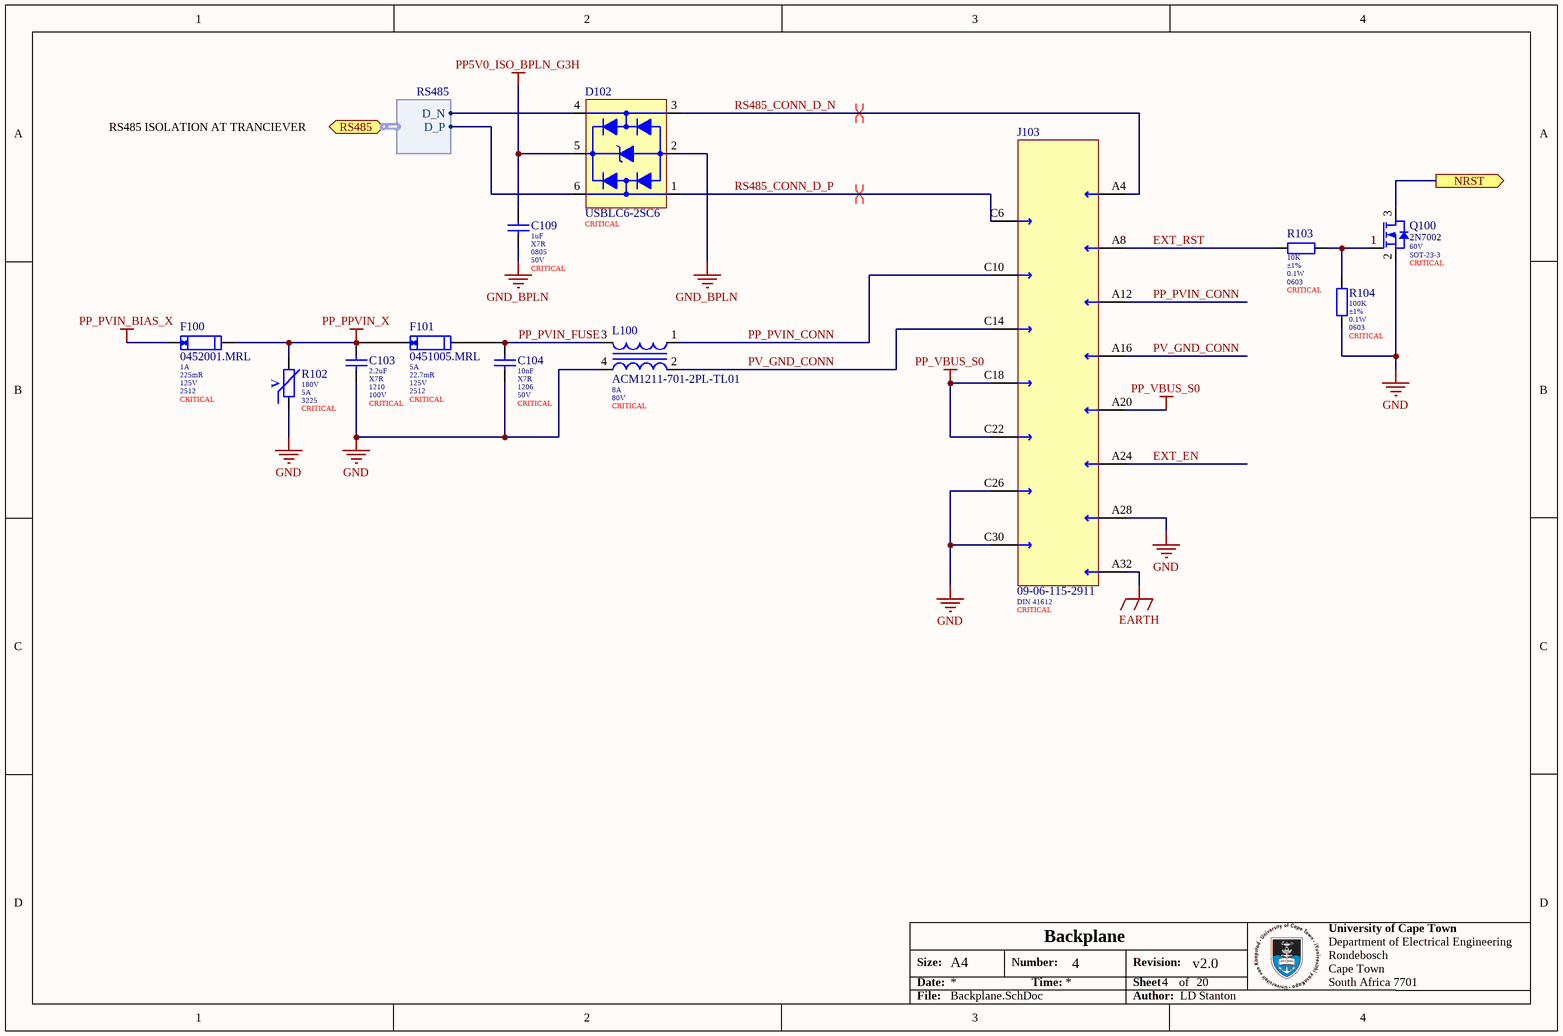
[diagram p13: Backplane.SchDoc]

### Parts
(Parts that share a designator on the sheet are numbered #1, #2 ... from top to bottom, then left to right.)
C103#2  value 2.2uF  Dielectric: X7R  Package: 1210  Voltage: 100V  Populate: CRITICAL  [1212_250_J (Samsumg) B]  (hidden comment: CL32B225KCJSNNE)
C104#2  value 10nF  Dielectric: X7R  Package: 1206  Voltage: 50V  Populate: CRITICAL  [1206_125 (Guandong) B]  (hidden comment: 1206B103K500NT)
C109  value 1uF  Dielectric: X7R  Package: 0805  Voltage: 50V  Populate: CRITICAL  [0805_125_F (Samsumg) B]  (hidden comment: CL21B105KBFNNNE)
D102  USBLC6-2SC6  Placement: CRITICAL  [SOT-23-6 (USBLC6-2SC6 ST) B]
F100#2  0452001.MRL  Current: 1A  Resistance: 225mR  Voltage: 125V  Package: 2512  Placement: CRITICAL  [Littlefuse 45x B]
F101#2  0451005.MRL  Current: 5A  Resistance: 22.7mR  Voltage: 125V  Package: 2512  Placement: CRITICAL  [Littlefuse 45x B]
J103  09-06-115-2911  Type: DIN 41612  Placement: CRITICAL  [090611529]
L100#2  ACM1211-701-2PL-TL01  Current: 8A  Voltage: 80V  Placement: CRITICAL  [ACM1211]
Q100  2N7002  Maximum Drain Source Voltage: 60V  Package: SOT-23-3  Placement: CRITICAL  [SOT-23-3 (2N7002) A]
R102#2  Varistor Voltage: 180V  Clamping Current: 5A  Package: 3225  Placement: CRITICAL  [3225 (B726) B]  (hidden comment: B72650M0111K072)
R103  value 10K  Tolerance: ±1%  Power: 0.1W  Package: 0603  Populate: CRITICAL  [0603 (Uniroyal) B]  (hidden comment: 0603WAF1002T5E)
R104  value 100K  Tolerance: ±1%  Power: 0.1W  Package: 0603  Populate: CRITICAL  [0603 (Uniroyal) B]  (hidden comment: 0603WAF1003T5E)

### Ports
NRST (out), RS485 (bidir, harness RS485)

### Harnesses
RS485: D_N, D_P

### Nets
EARTH: J103.A32
GND: C103#2.2 C104#2.2 J103.A28 J103.C26 J103.C30 L100#2.4 Q100.2(S) R102#2.1 R104.2
GND_BPLN: C109.2 D102.2(GND)
PP5V0_ISO_BPLN_G3H: C109.1 D102.5(VBUS)
PP_PPVIN_X: C103#2.1 F100#2.1 F101#2.2 R102#2.2
PP_PVIN_BIAS_X: F100#2.2
PP_VBUS_S0: J103.A20 J103.C18 J103.C22
EXT_EN: J103.A24
EXT_RST: J103.A8 R103.1
PP_PVIN_CONN: J103.A12 J103.C10 L100#2.1
PP_PVIN_FUSE: C104#2.1 F101#2.1 L100#2.3
PV_GND_CONN: J103.A16 J103.C14 L100#2.2
RS485.D_N: D102.4(I/O_3) ; port RS485.D_N
RS485.D_P: D102.6(I/O_4) ; port RS485.D_P
RS485_CONN_D_N: D102.3(I/O_2) J103.A4
RS485_CONN_D_P: D102.1(I/O_1) J103.C6
NetQ100_1: Q100.1(G) R103.2 R104.1
NetQ100_3: Q100.3(D) ; port NRST

### Layout directives
differential pair: RS485_CONN_D_N, RS485_CONN_D_P

### Notes on the sheet
- RS485 ISOLATION AT TRANCIEVER
- Size:
- Date:
- A4
- Number:
- Time:
- Revision:
- Sheet
- of
- File:
- Author:
- (in symbol CMP-000045-3) V

### Library data of the parts
C103#2 = CMP-014-000010-1: as C502-C504 on sheet Bias Regulators 1; LCSC Part Number: C55151; Tolerance: ±10%; ComponentLink1URL: https://datasheet.lcsc.com/szlcsc/Samsung-Electro-Mechanics-CL05C100JB5NNNC_C32949.pdf; ComponentLink1Description: Datasheet
C104#2 = CMP-014-000019-1: MLCC 10nF 1206 50V X7R ±10%; Manufacturer: Guandong; ComponentLink1URL: https://datasheet.lcsc.com/szlcsc/Guangdong-Fenghua-Advanced-Tech-0402B102K500NT_C1523.pdf; Tolerance: ±10%; LCSC Part Number: C1846; ComponentLink1Description: Datasheet
C109 = CMP-045-000003-11: MLCC 1uF 0805 50V X7R ±10%; Manufacturer: Samsung; Tolerance: ±10%; LCSC Part Number: C28323; ComponentLink1Description: Datasheet; ComponentLink1URL: https://datasheet.lcsc.com/szlcsc/Samsung-Electro-Mechanics-CL05C100JB5NNNC_C32949.pdf
D102 = CMP-004-00000-2: TVS Diode Array Low Capacitance SOT23-6; Manufacturer: Tech Public; Peak Pulse Current: 5A; Breakdown Voltage: 6V; Leakage Current: 150nA; Capacitance: 3.5pF; Data Rate: 480Mbps; Clamping Voltage: 17V; Max Operating Temperature: 125°C; Case/Package: SOT-23-6; ComponentLink1URL: https://datasheet.lcsc.com/lcsc/2108132230_TECH-PUBLIC-USBLC6-2SC6_C2827654.pdf; ComponentLink1Description: Datasheet; Min Operating Temperature: -40°C; RoHS Compliant: Yes; LCSC Part Number: C2827654
F100#2 = CMP-005-00001-1: Fuse 1A 125VAC/VDC SMD Littlefuse; Body Material: Ceramic; RoHS Compliant: Yes; Max Operating Temperature: 125°C; Min Operating Temperature: -55°C; ComponentLink1URL: https://datasheet.lcsc.com/lcsc/1809191823_Littelfuse-0452001.MRL_C44669.pdf; LCSC Part Number: C44669; ComponentLink1Description: Datasheet
F101#2 = CMP-005-00002-1: Fuse 5A 125VAC/VDCSMD Littlefuse; Body Material: Ceramic; LCSC Part Number: C48467; Max Operating Temperature: 125°C; ComponentLink1Description: Datasheet; ComponentLink1URL: https://datasheet.lcsc.com/lcsc/1809291113_Littelfuse-0451010.MRL_C44479.pdf; Min Operating Temperature: -55°C; RoHS Compliant: Yes
J103 = CMP-000038-5: DIN 41612 Power Backplane Connector Right Angle 15 Spade Contacts 200mil Pitch; Contact Resistance: 8MR; ComponentLink1Description: Drawing; ComponentLink1URL: https://b2b.harting.com/files/download/PRD/PDF_TS/09061152911_100184612DRW017A.pdf
L100#2 = CMP-000044-4: Common Mode Choke 6mR 80V 8A 700R @ 100MHz; Min Operating Temperature: -40°C; Impedance: 700R; RoHS Compliant: Yes; Max Operating Temperature: 85°C; LCSC Part Number: C250214
Q100 = CMP-040-000000-14: Small Signal MOSFET, 500 mA, 60 V, N-Channel, Enhancement, JCET SOT-23-3; Gate Threshold Voltage: 2V5; Power: 0.225W; Maximum Drain Current: 0.2A; Maximum Gate Source Voltage: ±20V; Drain-Source On Resistance: 7R; ComponentLink1Description: Datasheet; LCSC Part Number: C8545; ComponentLink1URL: https://datasheet.lcsc.com/szlcsc/Changjiang-Electronics-Tech-CJ-2N7002_C8545.pdf; Manufacturer: JCET
R102#2 = CMP-000045-3: Varistor MLV 115VAC/150VDC Rated 400A Peak 180V Trigger 3225; Capacitance: 110pF; Max Surge Current: 100A; Voltage Rating (AC): 115V; Voltage Rating (DC): 150V; Clamping Voltage: 36V; Min Operating Temperature: -40°C; Max Operating Temperature: 85°C; Max Voltage Rating (DC): 150V; RoHS Compliant: Yes; LCSC Part Number: C211089
R103 = CMP-010-000293-9: Resistor 10K 0603 ±1% Thick Film Uniroyal; Working Voltage: 75V; Temperature Coefficient: ±100ppm/K; Temperature: -55 - 155°C; ComponentLink1URL: https://datasheet.lcsc.com/szlcsc/1811062009_UNI-ROYAL-Uniroyal-Elec-0603WAF1002T5E_C25804.pdf; LCSC Part Number: C25804; ComponentLink1Description: Datasheet; Pin Count: 2; Manufacturer: Uniroyal
R104 = CMP-010-000288-10: Resistor 100K 0603 ±1% Thick Film Uniroyal; Temperature Coefficient: ±100ppm/K; Working Voltage: 75V; LCSC Part Number: C25803; Temperature: -55 - 155°C; ComponentLink1URL: https://datasheet.lcsc.com/szlcsc/1811062009_UNI-ROYAL-Uniroyal-Elec-0603WAF1002T5E_C25804.pdf; Pin Count: 2; Manufacturer: Uniroyal; ComponentLink1Description: Datasheet

## Sheet Mechanical.SchDoc: Mechanical
size A4; ApprovedBy: LD Stanton; Author: LD Stanton; CompanyName: University of Cape Town; DrawnBy: Lawrence Stanton; Engineer: Lawrence Stanton; Organization: University of Cape Town; Address1: Department of Electrical Engineering; Address2: Rondebosch; Address3: Cape Town; Address4: South Africa 7701; DocumentNumber: 17; SheetNumber: 17; SheetTotal: 20
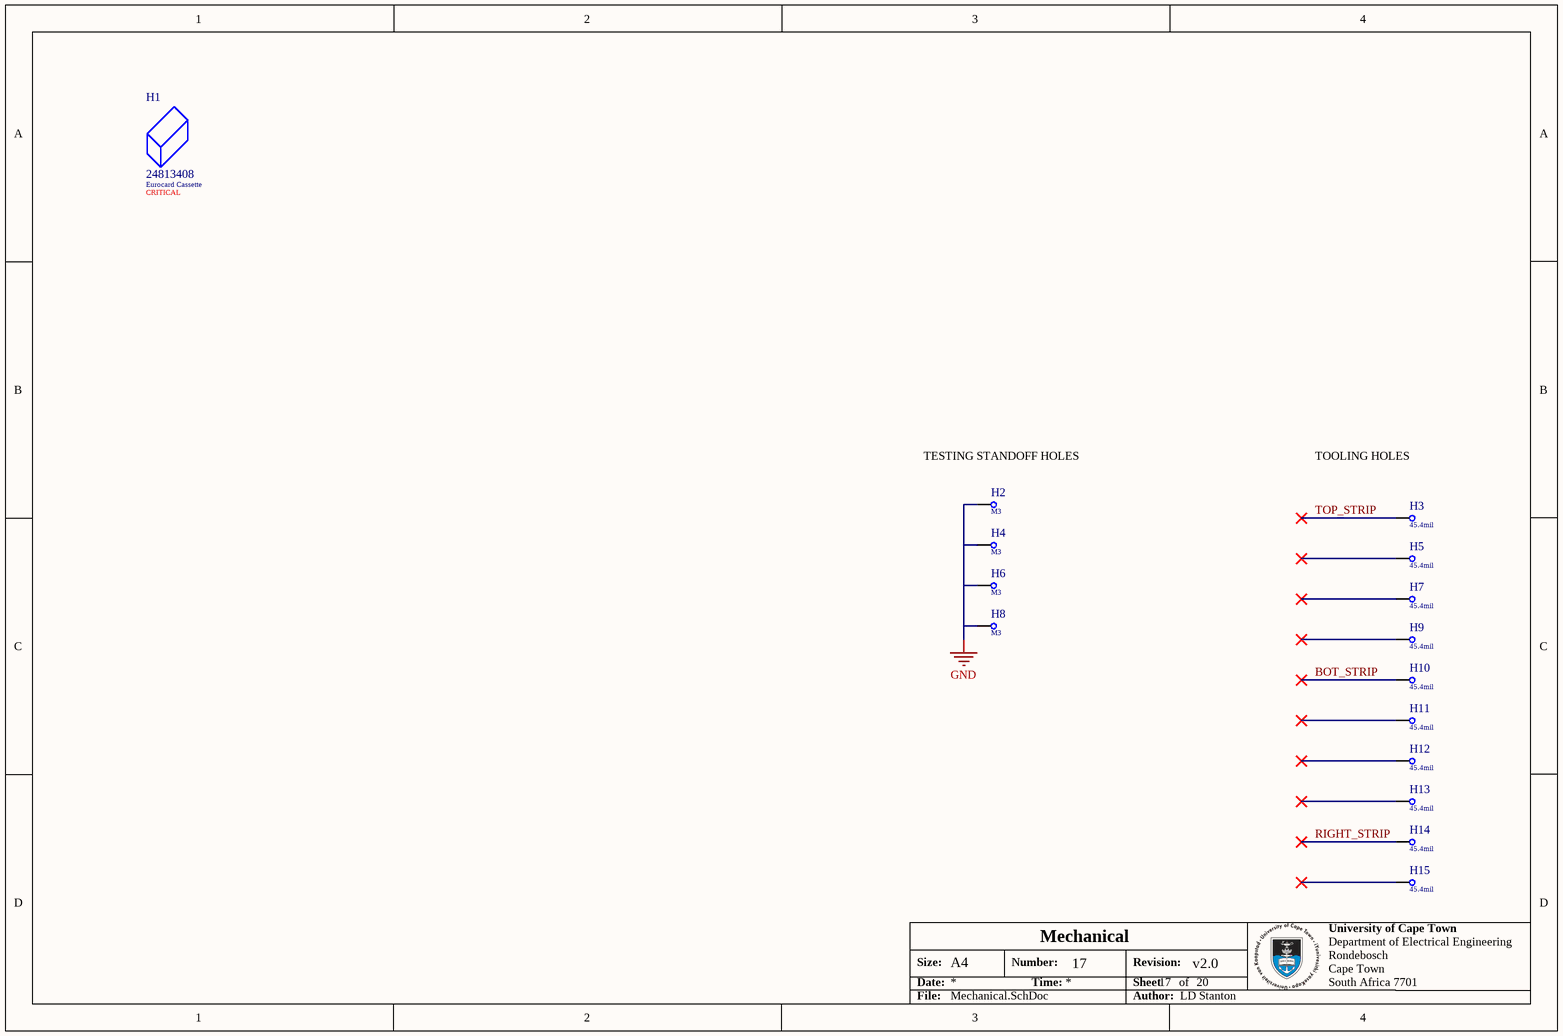
[diagram p14: Mechanical.SchDoc]

### Parts
H1  24813408  Type: Eurocard Cassette  Placement: CRITICAL  (mechanical)
H2  Size: M3  [Mounting Hole M3 Plated Tight Via]  (hidden comment: Mounting Hole M3)  (no BOM)
H3  Size: 45.4mil  [Tooling Hole JLCPCB]  (hidden comment: Tooling Hole JLCPCB)  (no BOM)
H4  Size: M3  [Mounting Hole M3 Plated Tight Via]  (hidden comment: Mounting Hole M3)  (no BOM)
H5  Size: 45.4mil  [Tooling Hole JLCPCB]  (hidden comment: Tooling Hole JLCPCB)  (no BOM)
H6  Size: M3  [Mounting Hole M3 Plated Tight Via]  (hidden comment: Mounting Hole M3)  (no BOM)
H7  Size: 45.4mil  [Tooling Hole JLCPCB]  (hidden comment: Tooling Hole JLCPCB)  (no BOM)
H8  Size: M3  [Mounting Hole M3 Plated Tight Via]  (hidden comment: Mounting Hole M3)  (no BOM)
H9  Size: 45.4mil  [Tooling Hole JLCPCB]  (hidden comment: Tooling Hole JLCPCB)  (no BOM)
H10  Size: 45.4mil  [Tooling Hole JLCPCB]  (hidden comment: Tooling Hole JLCPCB)  (no BOM)
H11  Size: 45.4mil  [Tooling Hole JLCPCB]  (hidden comment: Tooling Hole JLCPCB)  (no BOM)
H12  Size: 45.4mil  [Tooling Hole JLCPCB]  (hidden comment: Tooling Hole JLCPCB)  (no BOM)
H13  Size: 45.4mil  [Tooling Hole JLCPCB]  (hidden comment: Tooling Hole JLCPCB)  (no BOM)
H14  Size: 45.4mil  [Tooling Hole JLCPCB]  (hidden comment: Tooling Hole JLCPCB)  (no BOM)
H15  Size: 45.4mil  [Tooling Hole JLCPCB]  (hidden comment: Tooling Hole JLCPCB)  (no BOM)

### Nets
GND: H2.1 H4.1 H6.1 H8.1
BOT_STRIP: H10.1
RIGHT_STRIP: H14.1
TOP_STRIP: H3.1

Not connected (* = marked no-connect by the designer): H5 1*; H7 1*; H9 1*; H11 1*; H12 1*; H13 1*; H15 1*

### Notes on the sheet
- (near H2) TESTING STANDOFF HOLES
- TOOLING HOLES
- Size:
- Date:
- A4
- Number:
- Time:
- Revision:
- Sheet
- of
- File:
- Author:

### Library data of the parts
H1 = CMP-001-0000-2: Plug-in unit Pro, 3 HE, 8 TE, 24813-408, Schroff; ComponentLink1Description: Catalog; ComponentLink2URL: https://schroff.nvent.com/sites/g/files/hdkjer281/files/acquiadam/2020-11/64812-110.pdf?asset_type=Installation%20Manual%20/%20Instruction%20Sheet; ComponentLink1URL: https://schroff.nvent.com/sites/g/files/hdkjer281/files/acquiadam/2021-10/7_3_Kassetten_e.pdf?asset_type=Catalog; ComponentLink2Description: Manual; Mount: Plug-In
H2 H4 H6 H8 = CMP-00028-00004-3: M3 Mounting Hole
H3 H5 H7 H9-H15 = CMP-00028-00000-8: Tooling Hole Specified by JLCPCB